# Altium schematic sheet CarrierConnector.SchDoc
size A4; CompanyName: Technische Hochschule Nürnberg Georg Simon Ohm; Organization: UltraZohm; Address1: Kesslerplatz 12; Address2: 90489 Nürnberg; Address3: GERMANY; DocumentNumber: 3; SheetNumber: 3; SheetTotal: 6; Website: www.ultrazohm.com
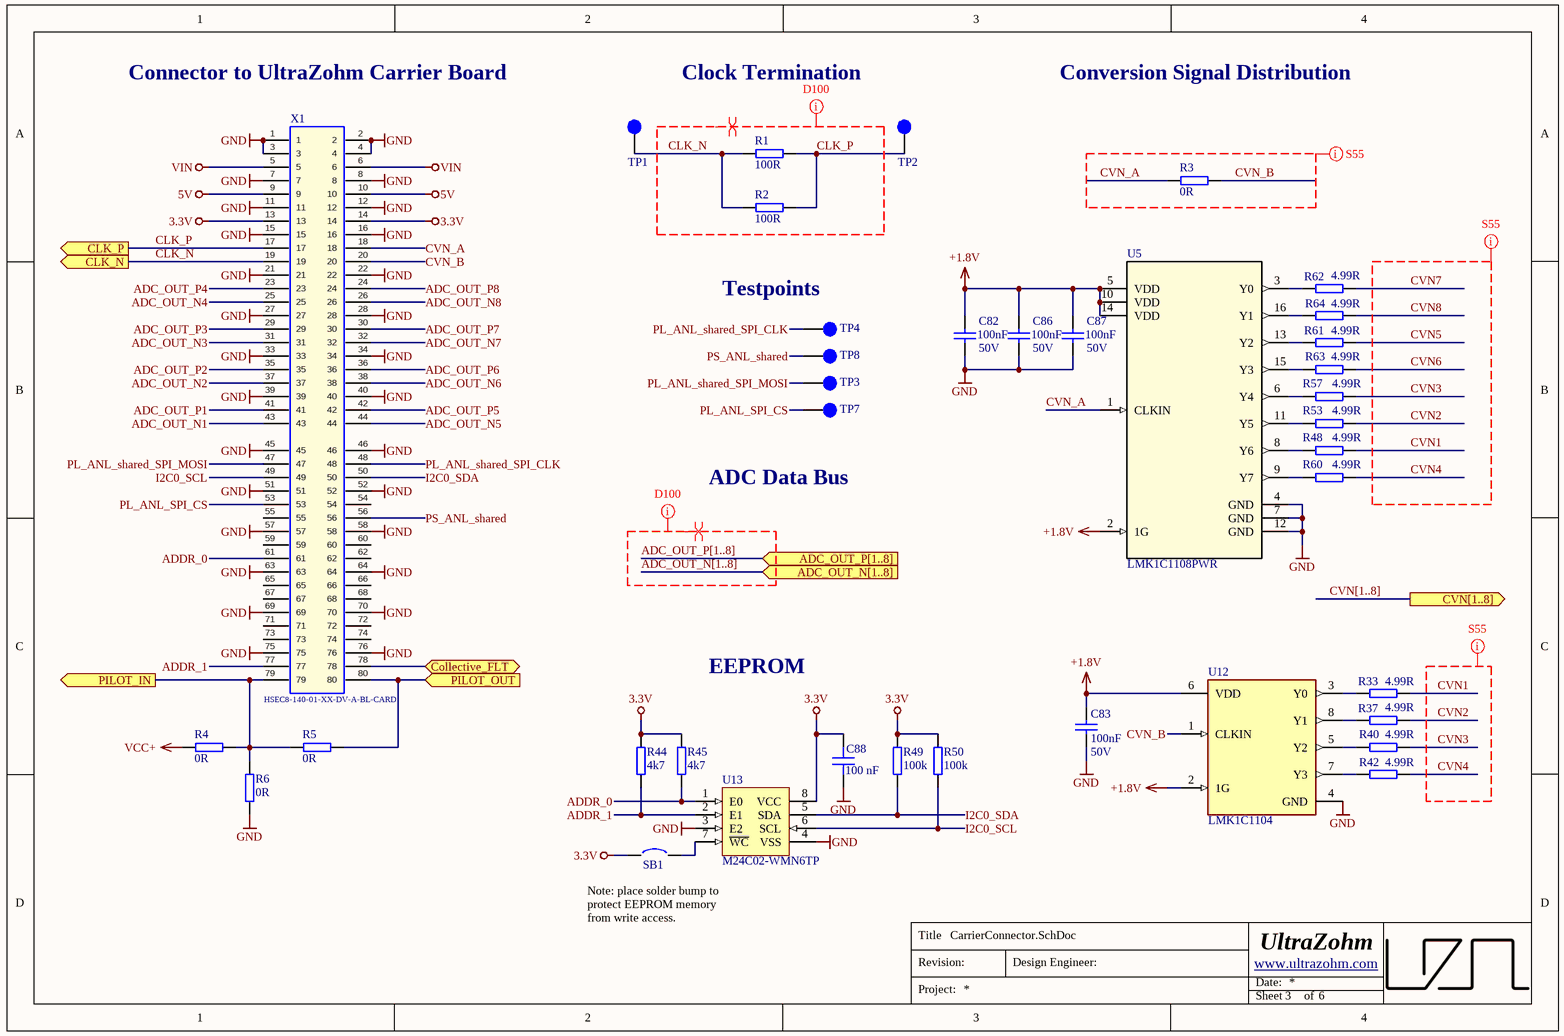
[diagram p0: CarrierConnector.SchDoc]

## Parts
C82  100nF  Voltage: 50V  [CAPC1608X07N]
C83  100nF  Voltage: 50V  [CAPC1608X07N]
C86  100nF  Voltage: 50V  [CAPC1608X07N]
C87  100nF  Voltage: 50V  [CAPC1608X07N]
C88  100 nF  [C_0603]
R1  100R  [RESC1608X06N]
R2  100R  [RESC1608X06N]
R3  0R  [RESC1608X06N]
R4  0R  [RESC1608X06N]
R5  0R  [RESC1608X06N]
R6  0R  [RESC1608X06N]
R33  4.99R  [RESC1608X06N]
R37  4.99R  [RESC1608X06N]
R40  4.99R  [RESC1608X06N]
R42  4.99R  [RESC1608X06N]
R44  4k7  [RES 0603_1608]
R45  4k7  [RES 0603_1608]
R48  4.99R  [RESC1608X06N]
R49  100k  [RES 0603_1608]
R50  100k  [RES 0603_1608]
R53  4.99R  [RESC1608X06N]
R57  4.99R  [RESC1608X06N]
R60  4.99R  [RESC1608X06N]
R61  4.99R  [RESC1608X06N]
R62  4.99R  [RESC1608X06N]
R63  4.99R  [RESC1608X06N]
R64  4.99R  [RESC1608X06N]
SB1  Solder Bump 0603  [SB_0603]  (value not drawn)  (no BOM)
TP1  ACLK_N  [TP_1mm]  (value not drawn)  (no BOM)
TP2  ACLK_P  [TP_1mm]  (value not drawn)  (no BOM)
TP3  PIN47  [TP_1mm]  (value not drawn)  (no BOM)
TP4  PIN48  [TP_1mm]  (value not drawn)  (no BOM)
TP7  PIN53  [TP_1mm]  (value not drawn)  (no BOM)
TP8  PIN56  [TP_1mm]  (value not drawn)  (no BOM)
U5  LMK1C1108PWR  [PW0016A_M]
U12  LMK1C1104  [FP-PW0008A-MFG]
U13  M24C02-WMN6TP  [D0008A_N]
X1  HSEC8-140-01-XX-DV-A-BL-CARD  [HSEC8-140-01-XX-DV-A-BL-CARD]  (no BOM)

## Ports
ADC_OUT_N[1..8] (in), ADC_OUT_P[1..8] (in), CLK_N (out), CLK_P (out), Collective_FLT (bidir), CVN[1..8] (out), PILOT_IN (out), PILOT_OUT (in)

## Nets
3.3V: C88.1 R44.2 R45.2 R49.2 R50.2 SB1.1 U13.8(VCC) X1.13 X1.14
5V: X1.9 X1.10
+1.8V: C82.1 C83.1 C86.1 C87.1 U5.2(1G) U5.5(VDD) U5.10(VDD) U5.14(VDD) U12.2(1G) U12.6(VDD)
GND: C82.2 C83.2 C86.2 C87.2 C88.2 R6.1 U5.4(GND) U5.7(GND) U5.12(GND) U12.4(GND) U13.3(E2) U13.4(VSS) X1.1 X1.2 X1.3 X1.4 X1.7 X1.8 X1.11 X1.12 X1.15 X1.16 X1.21 X1.22 X1.27 X1.28 X1.33 X1.34 X1.39 X1.40 X1.45 X1.46 X1.51 X1.52 X1.57 X1.58 X1.63 X1.64 X1.69 X1.70 X1.75 X1.76
VCC+: R4.1
VIN: X1.5 X1.6
ADC_OUT_N1: X1.43
ADC_OUT_N2: X1.37
ADC_OUT_N3: X1.31
ADC_OUT_N4: X1.25
ADC_OUT_N5: X1.44
ADC_OUT_N6: X1.38
ADC_OUT_N7: X1.32
ADC_OUT_N8: X1.26
ADC_OUT_P1: X1.41
ADC_OUT_P2: X1.35
ADC_OUT_P3: X1.29
ADC_OUT_P4: X1.23
ADC_OUT_P5: X1.42
ADC_OUT_P6: X1.36
ADC_OUT_P7: X1.30
ADC_OUT_P8: X1.24
ADDR_0: R45.1 U13.1(E0) X1.61
ADDR_1: R44.1 U13.2(E1) X1.77
CLK_N: R1.1 R2.1 TP1.1 X1.19 ; port CLK_N
CLK_P: R1.2 R2.2 TP2.1 X1.17 ; port CLK_P
Collective_FLT: X1.78 ; port Collective_FLT
CVN1: R33.2 R48.2
CVN2: R37.2 R53.2
CVN3: R40.2 R57.2
CVN4: R42.2 R60.2
CVN5: R61.2
CVN6: R63.2
CVN7: R62.2
CVN8: R64.2
CVN_A: R3.1 U5.1(CLKIN) X1.18
CVN_B: R3.2 U12.1(CLKIN) X1.20
I2C0_SCL: R50.1 U13.6(SCL) X1.49
I2C0_SDA: R49.1 U13.5(SDA) X1.50
PILOT_IN: R4.2 R5.1 R6.2 X1.79 ; port PILOT_IN
PILOT_OUT: R5.2 X1.80 ; port PILOT_OUT
PL_ANL_shared_SPI_CLK: TP4.1 X1.48
PL_ANL_shared_SPI_MOSI: TP3.1 X1.47
PL_ANL_SPI_CS: TP7.1 X1.53
PS_ANL_shared: TP8.1 X1.56
NetR33_1: R33.1 U12.3(Y0)
NetR37_1: R37.1 U12.8(Y1)
NetR40_1: R40.1 U12.5(Y2)
NetR42_1: R42.1 U12.7(Y3)
NetR48_1: R48.1 U5.8(Y6)
NetR53_1: R53.1 U5.11(Y5)
NetR57_1: R57.1 U5.6(Y4)
NetR60_1: R60.1 U5.9(Y7)
NetR61_1: R61.1 U5.13(Y2)
NetR62_1: R62.1 U5.3(Y0)
NetR63_1: R63.1 U5.15(Y3)
NetR64_1: R64.1 U5.16(Y1)
NetSB1_2: SB1.2 U13.7(~{WC})

Not connected (* = marked no-connect by the designer): X1 54 55 59 60 62 65 66 67 68 71 72 73 74

## Buses and harness runs
bus ADC_OUT_N[1..8] = port ADC_OUT_N[1..8]
bus ADC_OUT_P[1..8] = port ADC_OUT_P[1..8]
bus CVN[1..8] = port CVN[1..8]

## Layout directives
differential pair: ADC_OUT_N[1..8], ADC_OUT_P[1..8], CLK_N, CLK_P
net class D100: ADC_OUT_N[1..8], ADC_OUT_P[1..8], CLK_N, CLK_P
net class S55: CVN1, CVN2, CVN3, CVN4, CVN5, CVN6, CVN7, CVN8, CVN_A, CVN_B

## Notes on the sheet
- Connector to UltraZohm Carrier Board
- Clock Termination
- Conversion Signal Distribution
- (near TP4) Testpoints
- ADC Data Bus
- EEPROM
- Note: place solder bump to protect EEPROM memory from write access.
- Title
- Revision:
- Design Engineer:
- Date:
- Project:
- Sheet
- of

## Library data of the parts
C82 C83 C86 C87 = Cap_0603: MPN: CC0603KRX7R9BB104; MF: Yageo; Dielectric: X5R; Value: 100nF; Supplier 1: Mouser; Supplier 2: Mouser; Supplier Part Number 1: 603-CC603KRX7R9BB104; Supplier Part Number 2: 710-885382206004; Package: 0603
C88 = C0603C104K9PACTU: Capacitor 0603, 6.3 VDC, 100 nF, X5R; Manufacturer: KEMET; Tolerance: 10 %; Voltage Rating: 6.3 VDC; Created from: MGremer; Manufacturer Part Number: C0603C104K9PACTU; PartID: 70; Created On: 20.12.2020 13:54:13; ComponentLink1Description: Datasheet; ComponentLink1URL: https://www.mouser.de/datasheet/2/212/KEM_C1006_X5R_SMD-1103249.pdf; Component Type: Capacitor 0603; Device Package: 0603; Last Updated: 20.01.2021 13:57:36; Mounting Type: SMD; Operating Temperature: -55 - 85°C; Series: SMD Comm X5R; Supplier 1: Mouser; Supplier Part Number 1: 80-C0603C104K9P; Type: Capacitor; Value: 100 nF; Live Cycle Status: 1; Stock number: not stored; MF: KEMET; MPN: C0603C104K9PACTU; Package: 0603
R1 R2 = R_0603: MPN: AC0603FR-13100RL; MF: Yageo; Tolerance: 1%; Value: 100R; Supplier 1: Mouser; Supplier Part Number 1: 603-AC0603FR-13100RL; Package: 0603
R3-R6 = R_0603: MPN: CRCW06030000Z0EBC; MF: Vishay / Dale; Value: 0R; Supplier 1: Mouser; Supplier Part Number 1: 71-CRCW06030000Z0EBC; Package: 0603
R33 R37 R40 R42 R48 R53 R57 R60-R64 = R_0603: MPN: CRCW06034R99FKEA; MF: Vishay / Dale; Tolerance: 1%; Value: 4.99R; Supplier 1: Mouser; Supplier Part Number 1: 71-CRCW0603-4.99-E3; Package: *
R44 R45 = 0603WAF4701T5E: SMD resistor E24 series; Manufacturer: UNI-ROYAL; Tolerance: 1%; Created from: AGeiger; Manufacturer Part Number: 0603WAF4701T5E; PartID: 90; Created On: 14.12.2020 16:17:14; ComponentLink1Description: Datasheet; ComponentLink1URL: https://datasheet.lcsc.com/lcsc/2206010116_UNI-ROYAL-Uniroyal-Elec-0603WAF4701T5E_C23162.pdf; Component Type: SMD resistor; Device Package: 0603; Last Updated: 25.08.2022 20:03:04; Mounting Type: SMD; Supplier 1: LCSC; Supplier Part Number 1: C23162; Type: Resistor; Value: 4k7; Live Cycle Status: 1; Stock number: Labor SMD Container; LCSC Part Number: C23162; Package: 0603
R49 R50 = RK73B1JTTD104J: SMD resistor E24 series; Manufacturer: KOA Speer; Tolerance: 5%; Created from: MGremer; Manufacturer Part Number: RK73B1JTTD104J; PartID: 122; Created On: 14.12.2020 16:17:14; ComponentLink1Description: Datasheet; ComponentLink1URL: https://www.mouser.de/datasheet/2/219/RK73B-1825463.pdf; Component Type: SMD resistor; Device Package: 0603; Last Updated: 27.05.2022 14:04:10; Mounting Type: SMD; Supplier 1: Mouser; Supplier Part Number 1: 660-RK73B1JTTD104J; Type: Resistor; Value: 100k; Live Cycle Status: 1; Stock number: Labor SMD Container; LCSC Part Number: C25803
SB1 = =Value: Created from: AGeiger; Revision: July-2002: Re-released for DXP Platform.; PartID: 1; Created On: 09.01.2024 17:13:56; Component Type: Solder Bump; Device Package: 0603; Last Updated: 09.01.2024 17:13:56; Manufacturer Part Number: Solder Bump 0603; Mounting Type: SMD; Value: Solder Bump 0603
TP1-TP4 TP7 TP8 = TP_1mm: Testpoint 1mm; Created: 2018_06_25_AGeiger; Value: Testpoint 1mm
U5 = LMK1C1108PWR: 8-channel output LVCMOS 1.8V buffer; MF: Texas Instruments; MPN: LMK1C1108PWR; Supplier 1: Digi-Key; Supplier 2: Mouser; Supplier Part Number 1: 296-LMK1C1108PWRCT-ND; Supplier Part Number 2: 595-LMK1C1108PWR
U12 = LMK1C1104: 4-channel output LVCMOS 1.8-V buffer; Manufacturer: Texas Instruments; Manufacturer Part Number: LMK1C1104PWR; Number of Outputs: 4; Frequency: 250MHz; Max Supply Voltage: 3.465V; Min Supply Voltage: 1.71V; Propagation Delay: 3ns; Mount: Surface Mount; Package: TSSOP; Number of Pins: 8; Input: LVCMOS; Supplier 1: Mouser; Supplier Part Number 1: 595-LMK1C1104PWR; ComponentLink1Description: Manufacturer; ComponentLink1URL: https://www.ti.com/; ComponentLink2Description: Datasheet; ComponentLink2URL: https://www.ti.com/lit/ds/symlink/lmk1c1104.pdf?ts=1616933763692&ref_url=https%253A%252F%252Fwww.ti.com%252Fproduct%252FLMK1C1104; Supplier 2: Mouser; Supplier Part Number 2: 972-5PB1104PGGK8; MF: Texas Instruments; MPN: LMK1C1104PWR
U13 = M24C02-WMN6TP: 2Kbit I2C SOP-8 EEPROM ROHS; Manufacturer: STMicroelectronics; Created from: AGeiger; Manufacturer Part Number: M24C02-WMN6TP; PartID: 1; Created On: 19.11.2023 14:54:27; ComponentLink1Description: Datasheet; ComponentLink1URL: https://www.st.com/resource/en/datasheet/m24c01-w.pdf; Component Type: EEPROM; Device Package: SOIC-8; Last Updated: 19.11.2023 21:39:04; Mounting Type: SMD; Operating Temperature: -40 to +85 °C; Series: M24xxx; Supplier 1: Mouser; Supplier Part Number 1: 511-M24C02-WMN6TP; Supplier 2: LCSC; Supplier Part Number 2: C7562; Type: Memory; Value: M24C02-WMN6TP; LCSC Part Number: C7562; MF: STMicroelectronics; MPN: M24C02-WMN6TP
X1 = HSEC8-140-01-XX-DV-A-BL-CARD: Mating Card Layout for HSEC8-140-01-XX-DV-A-BL; Manufacturer: SAMTEC; Created: 2018_04_23_AGeiger; Value: HSEC8-140-01-XX-DV-A-BL-CARD; ComponentLink1Description: Info; ComponentLink1URL: https://www.samtec.com/de/products/hsec8-140-01-l-dv-a-bl-k-tr; MF: SAMTEC